# Altium schematic sheet 1_ADSTM32-Power.SchDoc
size A; SheetNumber: 2; SheetTotal: 4
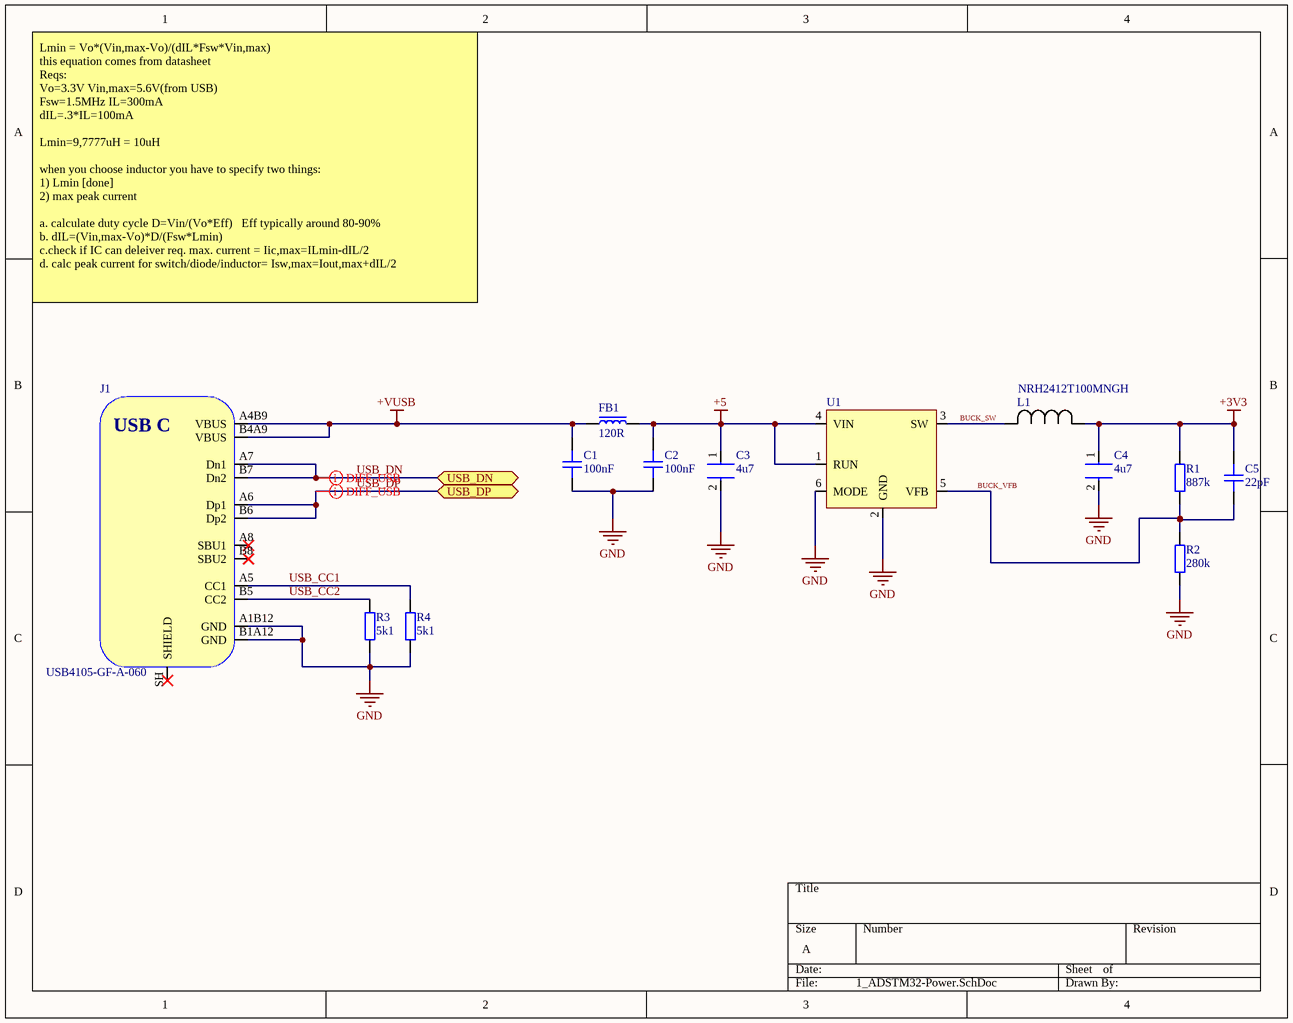
[diagram p0: 1_ADSTM32-Power.SchDoc]

## Parts
C1  100nF  [CAP_0603]
C2  100nF  [CAP_0603]
C3  4u7  [C2012X7R1C475K125AE]
C4  4u7  [C2012X7R1C475K125AE]
C5  22pF  [CAP_0603]
FB1  120R  [FB_0603]
J1  USB4105-GF-A-060  [USB4105-GF-A-060]
L1  NRH2412T100MNGH  [NRH2412T100MNGH]
R1  887k  [RES_0603]
R2  280k  [RES_0603]
R3  5k1  [RES_0603]
R4  5k1  [RES_0603]
U1  LTC3405ES6#TRMPBF  [SOT-23-6]  (value not drawn)

## Ports
USB_DN (bidir), USB_DP (bidir)

## Nets
+3V3: C4.1 C5.2 L1.1 R1.2
+5: C2.2 C3.1 FB1.2 U1.1(RUN) U1.4(VIN)
+VUSB: C1.2 FB1.1 J1.A4B9(VBUS) J1.B4A9(VBUS)
GND: C1.1 C2.1 C3.2 C4.2 J1.A1B12(GND) J1.B1A12(GND) R2.1 R3.1 R4.1 U1.2(GND) U1.6(MODE)
BUCK_SW: L1.2 U1.3(SW)
BUCK_VFB: C5.1 R1.1 R2.2 U1.5(VFB)
USB_CC1: J1.A5(CC1) R4.2
USB_CC2: J1.B5(CC2) R3.2
USB_DN: J1.A7(Dn1) J1.B7(Dn2) ; port USB_DN
USB_DP: J1.A6(Dp1) J1.B6(Dp2) ; port USB_DP

Not connected (* = marked no-connect by the designer): J1 A8(SBU1)* B8(SBU2)* SH(SHIELD)*

## Layout directives
differential pair; differential pair class DIFF_USB: USB_DN, USB_DP

## Notes on the sheet
- Lmin = Vo*(Vin,max-Vo)/(dIL*Fsw*Vin,max)
  this equation comes from datasheet
  Reqs:
  Vo=3.3V Vin,max=5.6V(from USB)
  Fsw=1.5MHz IL=300mA
  dIL=.3*IL=100mA
  Lmin=9,7777uH = 10uH
  when you choose inductor you have to specify two things:
  1) Lmin [done]
  2) max peak current
  a. calculate duty cycle D=Vin/(Vo*Eff)   Eff typically around 80-90%
  b. dIL=(Vin,max-Vo)*D/(Fsw*Lmin)
  c.check if IC can deleiver req. max. current = Iic,max=ILmin-dIL/2
  d. calc peak current for switch/diode/inductor= Isw,max=Iout,max+dIL/2
- (in symbol USB4105-GF-A-060) USB C

## Library data of the parts
C1 C2 C5 = CAP_0603: Capacitor SMD 0603; Manufacturer: *; Manufacturer Part Number: *; Distributor Link: *; LCSC: *; Rating: *; Dielectric: *
C3 C4 = CAP_0805_16V: Multilayer Ceramic Capacitors MLCC - SMD/SMT 0805 16VDC 4.7uF 10% X7R 1.25mm; Manufacturer: TDK; Manufacturer Part Number: C2012X7R1C475K125AE
FB1 = FB_0603: Ferrite Bead SMD 0603; Manufacturer: *; Manufacturer Part Number: *; Distributor Link: *; LCSC: *
J1 = USB4105-GF-A-060: USB Connector Type C SMT 12 Pin; Manufacturer: GCT; Manufacturer Part Number: USB4105-GF-A-060; Distributor Link: https://eu.mouser.com/ProductDetail/GCT/USB4105-GF-A-060?qs=QNEnbhJQKvY2mocwNJzgfA%3D%3D
L1 = NRH2412T100MNGH: Power Inductors - SMD 963-LSXNE2424MKT100M RPLCMT PN 2412 10uH 600mOhms; Manufacturer: TAIYO YUDEN; Manufacturer Part Number: NRH2412T100MNGH
R1-R4 = RES_0603: Resistor SMD 0603; Manufacturer: *; Manufacturer Part Number: *; Distributor Link: *; LCSC: *
U1 = LTC3405ES6#TRMPBF: Switching Voltage Regulators 1.5MHz, 300mA Sync Buck Reg in SOT; Manufacturer: Analog Devices; Manufacturer Part Number: LTC3405ES6#TRMPBF